# Altium project 6_Channels_TX_V1.PrjPcb
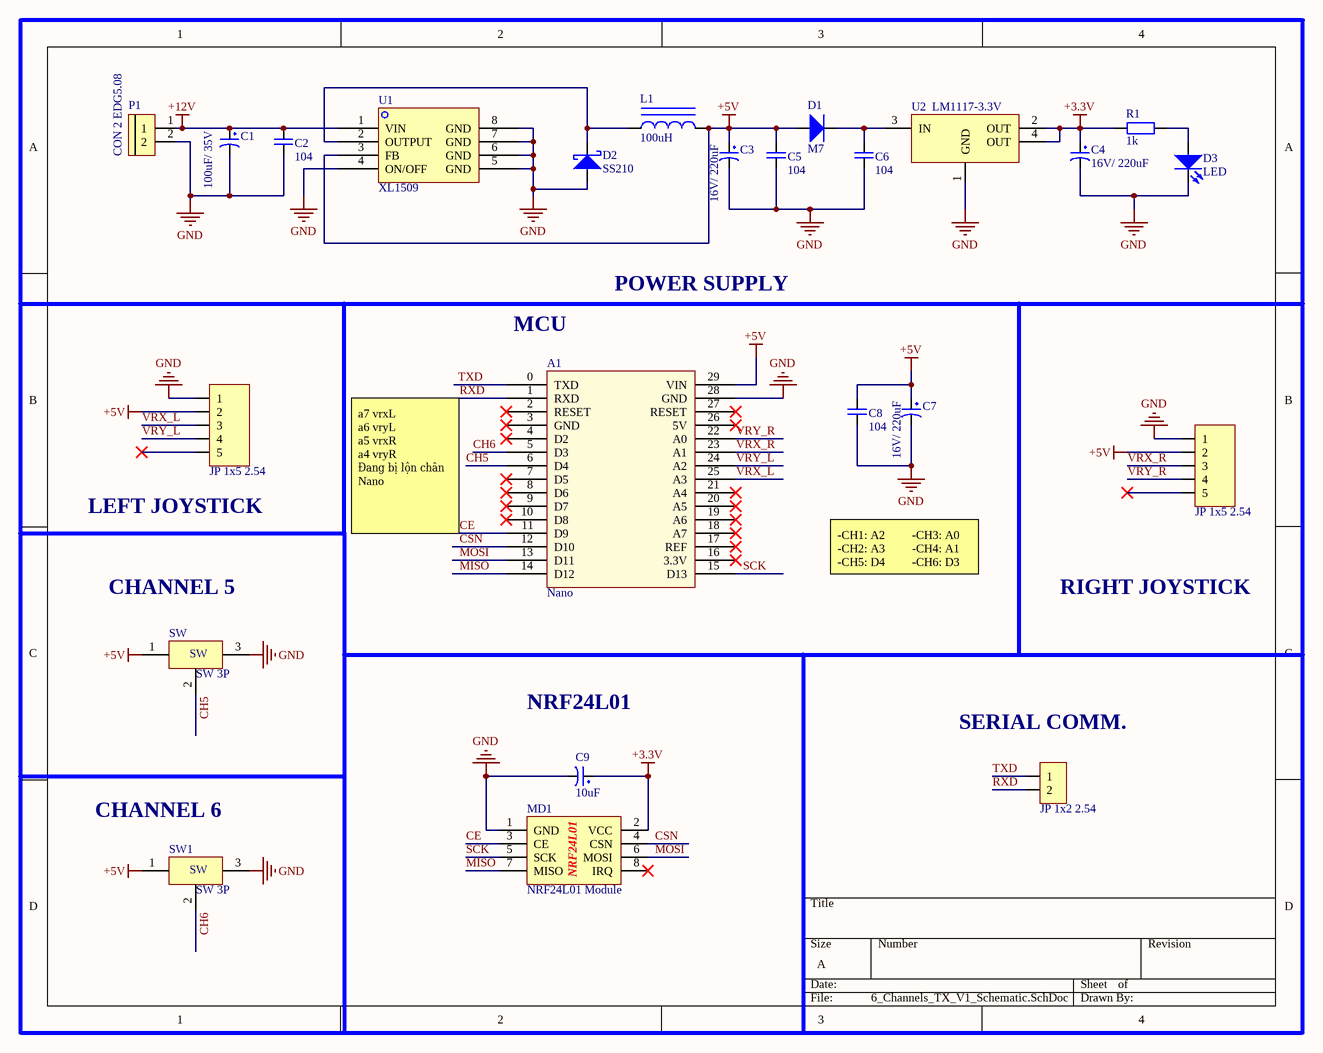
[diagram p0: 6_Channels_TX_V1_Schematic.SchDoc]
1 sheet, 24 parts. Net scope: global (net labels, ports and power ports of the same name join across sheets).
Board file: 6_Channels_TX_V1_PCB.PcbDoc

## Sheet 6_Channels_TX_V1_Schematic.SchDoc
size A; SheetNumber: 1; SheetTotal: 1

### Parts
A1  Nano  [Arduino nano]
C1  100uF/ 35V  [CAP SMD ALUMINUM D8]
C2  104  [SM-0805]
C3  16V/ 220uF  [CAP SMD ALUMINUM D8]
C4  16V/ 220uF  [CAP SMD ALUMINUM D8]
C5  104  [SM-0805]
C6  104  [SM-0805]
C7  16V/ 220uF  [CAP SMD ALUMINUM D8]
C8  104  [SM-0805]
C9  10uF  [tu hoa 8mm]
D1  M7  [DO-214AC]
D2  SS210  [DO-214AC]
D3  LED  [LED-3MM GRE]
JP1  JP 1x5 2.54  [JP 1x5 CC]
JP2  JP 1x5 2.54  [JP 1x5 CC]
JP3  JP 1x2 2.54  [JP 1x2 DT]
L1  100uH  [INDUCTOR SMD 7342 7.3X7.3X4.2mm]
MD1  NRF24L01 Module  [NRF24L01]
P1  CON 2 EDG5.08  [CON 2 2EDG5.08]
R1  1k  [RESISTOR SMD 0805]
SW  SW 3P  [MTS-102]
SW1  SW 3P  [MTS-102]
U1  XL1509  [SOP8]
U2  LM1117-3.3V  [SOT223-4N]

### Nets
+3.3V: C4.1 C9.1 MD1.2(VCC) R1.1 U2.2(OUT) U2.4(OUT)
+5V: A1.29(VIN) C3.1 C5.2 C7.1 C8.2 D1.1 JP1.2 JP2.2 L1.2 SW.1 SW1.1 U1.3(FB)
+12V: C1.1 C2.2 P1.1 U1.1(VIN)
GND: A1.28(GND) C1.2 C2.1 C3.2 C4.2 C5.1 C6.1 C7.2 C8.1 C9.2 D2.1 D3.2 JP1.1 JP2.1 MD1.1(GND) P1.2 SW.3 SW1.3 U1.4(ON/OFF) U1.5(GND) U1.6(GND) U1.7(GND) U1.8(GND) U2.1(GND)
CE: A1.11(D9) MD1.3(CE)
CH5: A1.6(D4) SW.2
CH6: A1.5(D3) SW1.2
CSN: A1.12(D10) MD1.4(CSN)
MISO: A1.14(D12) MD1.7(MISO)
MOSI: A1.13(D11) MD1.6(MOSI)
RXD: A1.1(RXD) JP3.2
SCK: A1.15(D13) MD1.5(SCK)
TXD: A1.0(TXD) JP3.1
VRX_L: A1.25(A3) JP1.3
VRX_R: A1.23(A1) JP2.3
VRY_L: A1.24(A2) JP1.4
VRY_R: A1.22(A0) JP2.4
NetC6_2: C6.2 D1.2 U2.3(IN)
NetD2_2: D2.2 L1.1 U1.2(OUTPUT)
NetD3_1: D3.1 R1.2

Not connected (* = marked no-connect by the designer): A1 2(RESET)* 3(GND)* 4(D2)* 7(D5)* 8(D6)* 9(D7)* 10(D8)* 16(3.3V)* 17(REF)* 18(A7)* 19(A6)* 20(A5)* 21(A4)* 26(5V)* 27(RESET)*; JP1 5*; JP2 5*; MD1 8(IRQ)*

### Notes on the sheet
- POWER SUPPLY
- (near A1) MCU
- (near JP1) LEFT JOYSTICK
- a7 vrxL
  a6 vryL
  a5 vrxR
  a4 vryR
  Đang bị lộn chân Nano
- -CH1: A2         -CH3: A0
  -CH2: A3         -CH4: A1
  -CH5: D4         -CH6: D3
- CHANNEL 5
- RIGHT JOYSTICK
- NRF24L01
- (near JP3) SERIAL COMM.
- (near SW1) CHANNEL 6
- (in symbol NRF24L01 Module) NRF24L01
- (in symbol SW 3P) SW

### Library data of the parts
A1 = Arduino Nano
C1 C3 C4 C7 = Cap_Polar
C2 C5 C6 C8 = Cap_Non-Polar
C9 = Tu Hoa 100uF 35V 8x11: Cắm; Don_Vi: Con; So_Chan: 2; Ten_Linh_Kien: Tụ Hóa 100uF 35V 8x11MM; Ma_Hang: MH002807; Chung_Loai: Cắm; Kieu_Chan: *
D1 = Diode Standard: Part Number: LED 3 ly Single Colour; Pricing: *
D2 = Diode Schottky: Part Number: LED 3 ly Single Colour; Pricing: *
D3 = LED: LED Single; Value: LED 3 ly Single Colour
JP1 JP2 = JP 1x5 2.54 Cai Cong: Cắm; Ten_Linh_Kien: Jump Đơn Cái 2.54MM 1x40P Cong; Don_Vi: Con; Ma_Hang: MH001265; Ghi_Chu: *; Kieu_Chan: *; Chung_Loai: Cắm
JP3 = JP 1x2 2.54 Duc Thang: Cắm; Ten_Linh_Kien: Jump Đơn Đực 2.54MM 1x40P Thẳng 11MM; Don_Vi: Con; Ma_Hang: MH000903; Ghi_Chu: *; Kieu_Chan: *; Chung_Loai: Cắm
L1 = Inductor Iron: Magnetic-Core Inductor; Value: 150 mH
P1 = CON 2 EDG5.08: Cắm; Ten_Linh_Kien: CON 2 2EDG5.08-2P 5.08MM ( Xanh Cong); Ma_Hang: MH000759; Ghi_Chu: *; Don_Vi: Con; Kieu_Chan: *; Chung_Loai: Cắm
R1 = Resistor
U1 = XL1509: IC power sop8
U2 = LM1117: 800mA Low-Dropout Linear Regulator; Creator: Nguyen Ba Bien; Website: http://group3i.net